# Altium schematic sheet Power.SchDoc
size A4; SheetNumber: 3; SheetTotal: 3
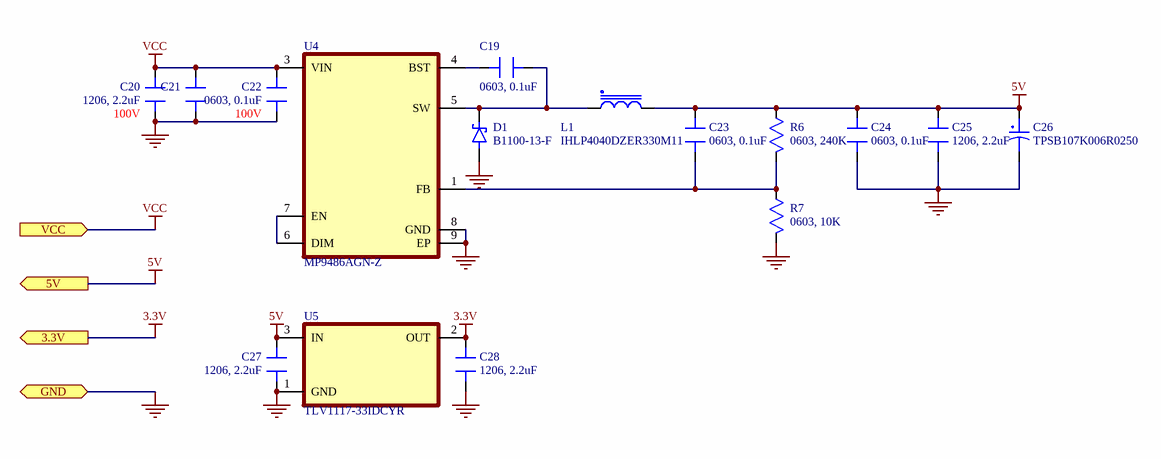
[diagram p0: Power.SchDoc]

## Parts
C19  0603, 0.1uF  [CAP 0603_1608]
C20  1206, 2.2uF  Voltage Rating: 100V  [CAP 1206_3216]
C21  1206, 2.2uF  [CAP 1206_3216]  (value not drawn)
C22  0603, 0.1uF  Voltage Rating: 100V  [CAP 0603_1608]
C23  0603, 0.1uF  [CAP 0603_1608]
C24  0603, 0.1uF  [CAP 0603_1608]
C25  1206, 2.2uF  [CAP 1206_3216]
C26  TPSB107K006R0250  [TPSB107K006R0250]
C27  1206, 2.2uF  [CAP 1206_3216]
C28  1206, 2.2uF  [CAP 1206_3216]
D1  B1100-13-F  [B1100-13-F]
L1  IHLP4040DZER330M11  [IHLP4040DZER330M11]
R6  0603, 240K  [RES 0603_1608]
R7  0603, 10K  [RES 0603_1608]
U4  MP9486AGN-Z  [MP9486AGN-Z]
U5  TLV1117-33IDCYR  [TLV1117-33IDCYR]

## Ports
3.3V (out, see Main[1B], Phase[1A]), 5V (out, see Main[1B], Phase[1A]), GND (bidir, see Main[1B], Phase[1A]), VCC (in, see Main[1B], Phase[1A])

## Nets
3.3V: C28.2 U5.2(OUT) ; port 3.3V
5V: C23.1 C24.1 C25.2 C26.1 C27.2 L1.2 R6.2 U5.3(IN) ; port 5V
GND: C20.1 C21.1 C22.1 C24.2 C25.1 C26.2 C27.1 C28.1 D1.A R7.1 U4.8(GND) U4.9(EP) U5.1(GND) ; port GND
VCC: C20.2 C21.2 C22.2 U4.3(VIN) ; port VCC
NetC19_1: C19.1 D1.C L1.1 U4.5(SW)
NetC19_2: C19.2 U4.4(BST)
NetC23_2: C23.2 R6.1 R7.2 U4.1(FB)
NetU4_6: U4.6(DIM) U4.7(EN)

## Library data of the parts
C19 C23 C24 = 0603 Kapasitör: Voltage Rating: 100V
C20 = 1206 Kapasitör
C21 C25 C27 C28 = 1206 Kapasitör: Voltage Rating: 100V
C22 = 0603 Kapasitör
R6 R7 = 0603 Direnç